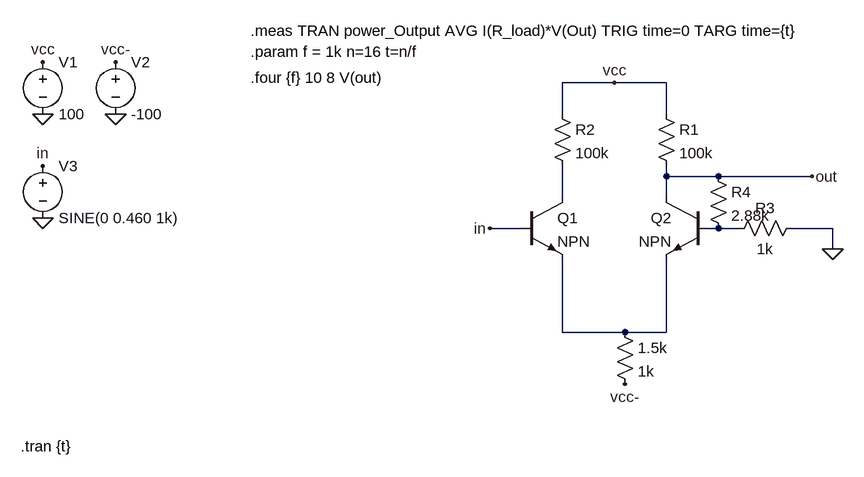
[diagram p0: schematic Draft2.asc]
Draft2.asc, the LTspice schematic file:
Version 4
SHEET 1 880 680
WIRE 240 -64 160 -64
WIRE 320 -64 240 -64
WIRE 160 -16 160 -64
WIRE 320 -16 320 -64
WIRE 320 80 320 64
WIRE 400 80 320 80
WIRE 544 80 400 80
WIRE 160 112 160 64
WIRE 320 112 320 80
WIRE 96 160 48 160
WIRE 400 160 384 160
WIRE 432 160 400 160
WIRE 576 160 512 160
WIRE 576 192 576 160
WIRE 160 320 160 208
WIRE 256 320 160 320
WIRE 320 320 320 208
WIRE 320 320 256 320
FLAG 544 80 out
FLAG -640 -16 0
FLAG -528 -16 0
FLAG -640 -96 vcc
FLAG -528 -96 vcc-
FLAG 256 400 vcc-
FLAG 240 -64 vcc
FLAG 576 192 0
FLAG 48 160 in
FLAG -640 144 0
FLAG -640 64 in
SYMBOL npn 96 112 R0
SYMATTR InstName Q1
SYMBOL npn 384 112 M0
SYMATTR InstName Q2
SYMBOL res 240 304 R0
SYMATTR InstName 1.5k
SYMATTR Value 1k
SYMBOL voltage -640 -112 R0
WINDOW 123 0 0 Left 0
WINDOW 39 0 0 Left 0
SYMATTR InstName V1
SYMATTR Value 100
SYMBOL voltage -528 -112 R0
WINDOW 123 0 0 Left 0
WINDOW 39 0 0 Left 0
SYMATTR InstName V2
SYMATTR Value -100
SYMBOL res 528 144 R90
WINDOW 0 0 56 VBottom 2
WINDOW 3 32 56 VTop 2
SYMATTR InstName R3
SYMATTR Value 1k
SYMBOL res 384 64 R0
SYMATTR InstName R4
SYMATTR Value 2.88k
SYMBOL voltage -640 48 R0
WINDOW 123 0 0 Left 0
WINDOW 39 0 0 Left 0
SYMATTR InstName V3
SYMATTR Value SINE(0 0.460 1k)
SYMBOL res 144 -32 R0
SYMATTR InstName R2
SYMATTR Value 100k
SYMBOL res 304 -32 R0
SYMATTR InstName R1
SYMATTR Value 100k
TEXT -674 496 Left 2 !.tran {t}
TEXT -320 -112 Left 2 !.param f = 1k n=16 t=n/f
TEXT -320 -72 Left 2 !.four {f} 10 8 V(out)
TEXT -320 -144 Left 2 !.meas TRAN power_Output AVG I(R_load)*V(Out) TRIG time=0 TARG time={t}

The netlist it stands for:
* Draft2.asc
Q1 N001 in N003 0 NPN
Q2 out N002 N003 0 NPN
R§1.5k N003 vcc- 1k
V1 vcc 0 100
V2 vcc- 0 -100
R3 0 N002 1k
R4 out N002 2.88k
V3 in 0 SINE(0 0.460 1k)
R2 vcc N001 100k
R1 vcc out 100k
.model NPN NPN
.model PNP PNP
.lib standard.bjt
.tran {t}
.param f = 1k n=16 t=n/f
.four {f} 10 8 V(out)
.meas TRAN power_Output AVG I(R_load)*V(Out) TRIG time=0 TARG time={t}
.backanno
.end